# EAGLE schematic barometr (EAGLE 7.5.0)
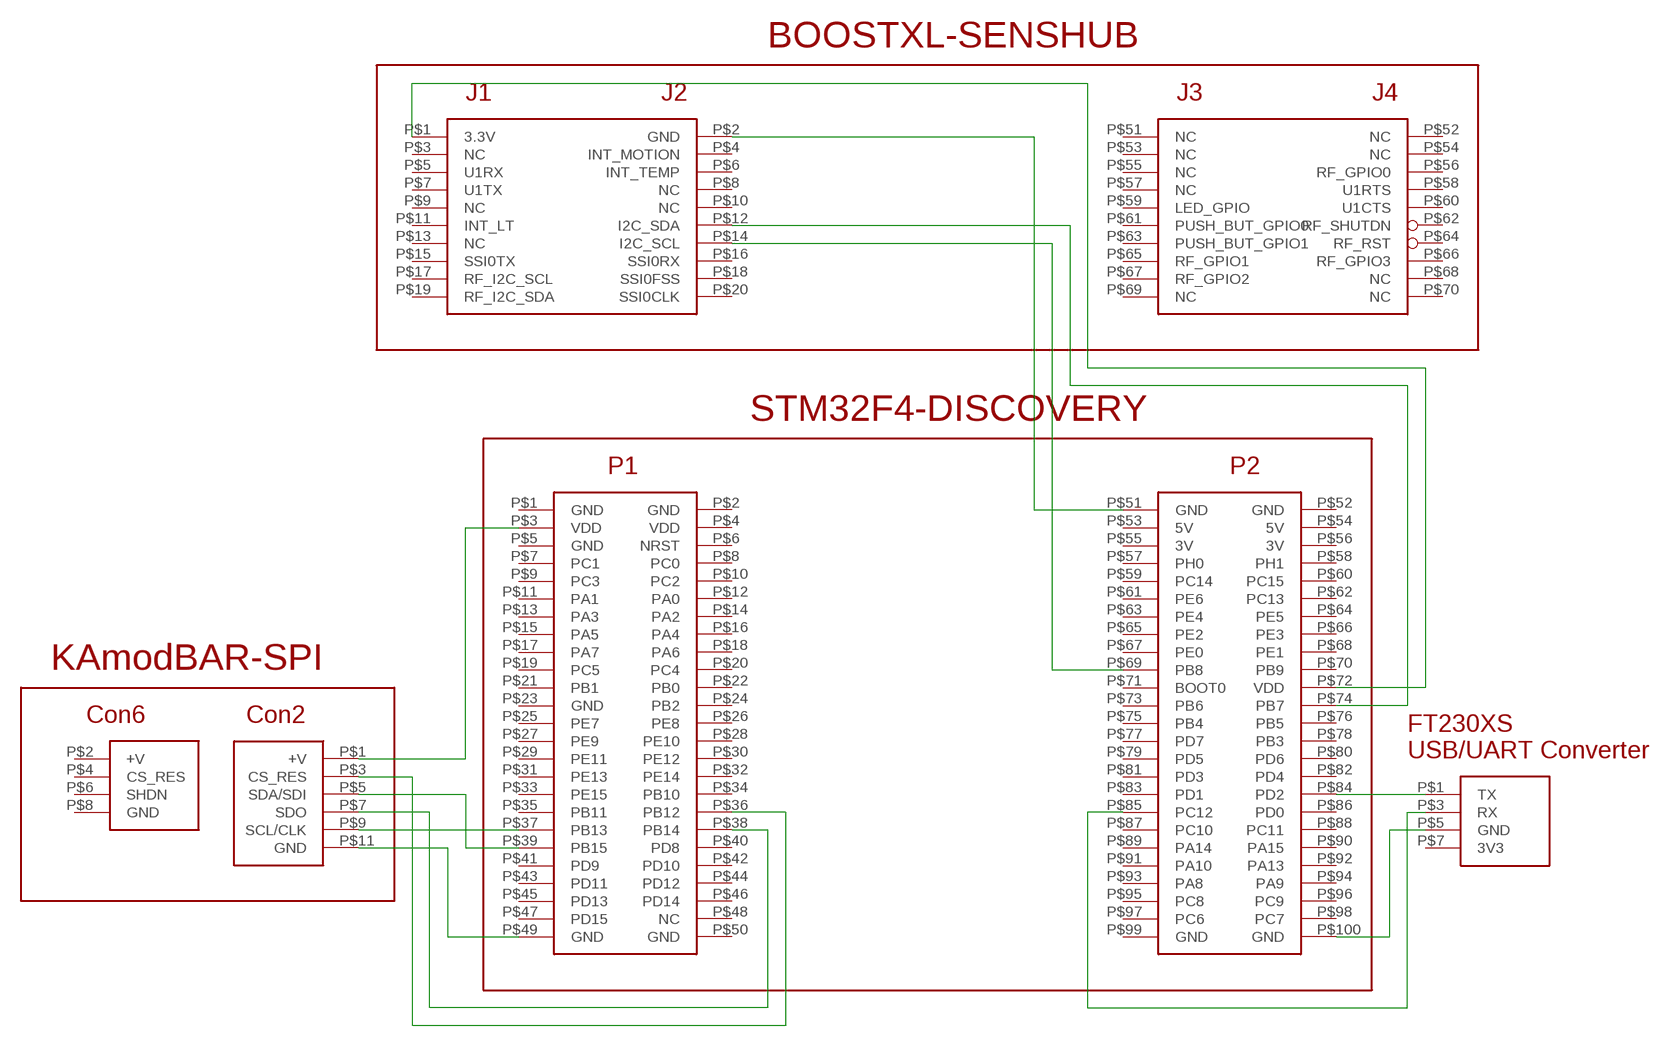
[diagram p0: schematic, sheet 1]

## Parts
U$1  STM32F4-DISCOVERY  [STM32F4-DISCOVERY]
U$2  BOOSTXL-SENSHUB  [BOOSTXL-SENSHUB]
U$3  KAMODBAR-SPI  [KAMODBAR-SPI]
U$4  FT230XS_UART_USB_CONVERTER  [FT230XS_UART_USB_CONVERTER]

## Nets
N$1: U$1.P$85(PC12) U$4.P$3(RX)
N$2: U$1.P$84(PD2) U$4.P$1(TX)
N$3: U$1.P$100(GND) U$4.P$5(GND)
N$4: U$1.P$36(PB12) U$3.P$3(CS_RES)
N$5: U$1.P$37(PB13) U$3.P$9(SCL/CLK)
N$6: U$1.P$38(PB14) U$3.P$7(SDO)
N$7: U$1.P$39(PB15) U$3.P$5(SDA/SDI)
N$8: U$1.P$3(VDD) U$3.P$1(+V)
N$9: U$1.P$49(GND) U$3.P$11(GND)
N$10: U$1.P$69(PB8) U$2.P$14(I2C_SCL)
N$11: U$1.P$74(PB7) U$2.P$12(I2C_SDA)
N$12: U$1.P$51(GND) U$2.P$2(GND)
N$13: U$1.P$72(VDD) U$2.P$1(3.3V)
Unconnected: U$1.P$1(GND) U$1.P$2(GND) U$1.P$4(VDD) U$1.P$5(GND) U$1.P$6(NRST) U$1.P$7(PC1) U$1.P$8(PC0) U$1.P$9(PC3) U$1.P$10(PC2) U$1.P$11(PA1) U$1.P$12(PA0) U$1.P$13(PA3) U$1.P$14(PA2) U$1.P$15(PA5) U$1.P$16(PA4) U$1.P$17(PA7) U$1.P$18(PA6) U$1.P$19(PC5) U$1.P$20(PC4) U$1.P$21(PB1) U$1.P$22(PB0) U$1.P$23(GND) U$1.P$24(PB2) U$1.P$25(PE7) U$1.P$26(PE8) U$1.P$27(PE9) U$1.P$28(PE10) U$1.P$29(PE11) U$1.P$30(PE12) U$1.P$31(PE13) U$1.P$32(PE14) U$1.P$33(PE15) U$1.P$34(PB10) U$1.P$35(PB11) U$1.P$40(PD8) U$1.P$41(PD9) U$1.P$42(PD10) U$1.P$43(PD11) U$1.P$44(PD12) U$1.P$45(PD13) U$1.P$46(PD14) U$1.P$47(PD15) U$1.P$48(NC) U$1.P$50(GND) U$1.P$52(GND) U$1.P$53(5V) U$1.P$54(5V) U$1.P$55(3V) U$1.P$56(3V) U$1.P$57(PH0) U$1.P$58(PH1) U$1.P$59(PC14) U$1.P$60(PC15) U$1.P$61(PE6) U$1.P$62(PC13) U$1.P$63(PE4) U$1.P$64(PE5) U$1.P$65(PE2) U$1.P$66(PE3) U$1.P$67(PE0) U$1.P$68(PE1) U$1.P$70(PB9) U$1.P$71(BOOT0) U$1.P$73(PB6) U$1.P$75(PB4) U$1.P$76(PB5) U$1.P$77(PD7) U$1.P$78(PB3) U$1.P$79(PD5) U$1.P$80(PD6) U$1.P$81(PD3) U$1.P$82(PD4) U$1.P$83(PD1) U$1.P$86(PD0) U$1.P$87(PC10) U$1.P$88(PC11) U$1.P$89(PA14) U$1.P$90(PA15) U$1.P$91(PA10) U$1.P$92(PA13) U$1.P$93(PA8) U$1.P$94(PA9) U$1.P$95(PC8) U$1.P$96(PC9) U$1.P$97(PC6) U$1.P$98(PC7) U$1.P$99(GND) U$2.P$3(NC) U$2.P$4(INT_MOTION) U$2.P$5(U1RX) U$2.P$6(INT_TEMP) U$2.P$7(U1TX) U$2.P$8(NC) U$2.P$9(NC) U$2.P$10(NC) U$2.P$11(INT_LT) U$2.P$13(NC) U$2.P$15(SSI0TX) U$2.P$16(SSI0RX) U$2.P$17(RF_I2C_SCL) U$2.P$18(SSI0FSS) U$2.P$19(RF_I2C_SDA) U$2.P$20(SSI0CLK) U$2.P$51(NC) U$2.P$52(NC) U$2.P$53(NC) U$2.P$54(NC) U$2.P$55(NC) U$2.P$56(RF_GPIO0) U$2.P$57(NC) U$2.P$58(U1RTS) U$2.P$59(LED_GPIO) U$2.P$60(U1CTS) U$2.P$61(PUSH_BUT_GPIO0) U$2.P$62(RF_SHUTDN) U$2.P$63(PUSH_BUT_GPIO1) U$2.P$64(RF_RST) U$2.P$65(RF_GPIO1) U$2.P$66(RF_GPIO3) U$2.P$67(RF_GPIO2) U$2.P$68(NC) U$2.P$69(NC) U$2.P$70(NC) U$3.P$2(+V) U$3.P$4(CS_RES) U$3.P$6(SHDN) U$3.P$8(GND) U$4.P$7(3V3)

## Library data of the parts
U$1 = STM32F4-DISCOVERY:STM32F4-DISCOVERY
U$2 = BOOSTXL-SENSHUB:BOOSTXL-SENSHUB
U$3 = KAMODBAR-SPI:KAMODBAR-SPI
U$4 = FT230XS_uart_usb_converter:FT230XS_UART_USB_CONVERTER